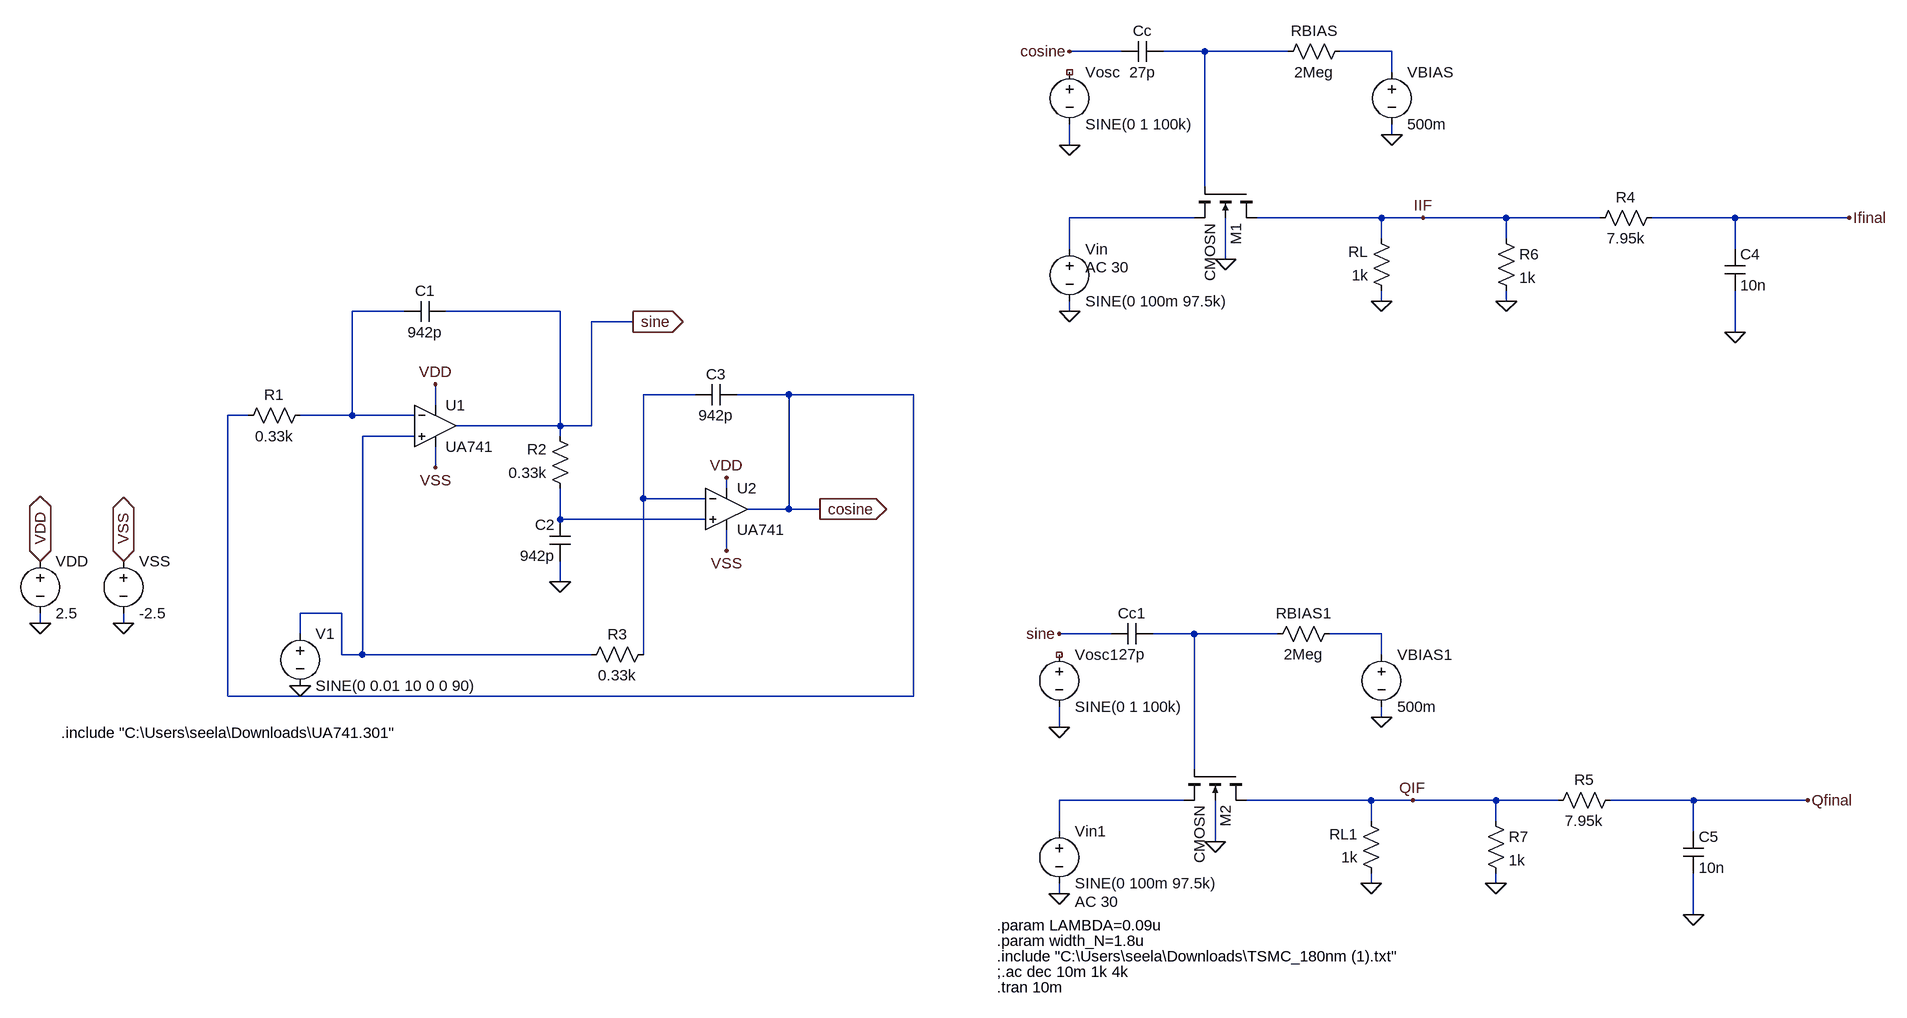
[diagram p0: schematic final.asc]
final.asc, the LTspice schematic file:
Version 4
SHEET 1 3272 1040
WIRE 1216 -416 1136 -416
WIRE 1344 -416 1280 -416
WIRE 1472 -416 1344 -416
WIRE 1632 -416 1552 -416
WIRE 1632 -384 1632 -416
WIRE 1632 -288 1632 -304
WIRE 1136 -272 1136 -304
WIRE 1344 -208 1344 -416
WIRE 1328 -160 1136 -160
WIRE 1616 -160 1424 -160
WIRE 1680 -160 1616 -160
WIRE 1808 -160 1680 -160
WIRE 1952 -160 1808 -160
WIRE 2160 -160 2032 -160
WIRE 2336 -160 2160 -160
WIRE 1616 -128 1616 -160
WIRE 1808 -128 1808 -160
WIRE 1136 -112 1136 -160
WIRE 2160 -112 2160 -160
WIRE 1376 -96 1376 -160
WIRE 1616 -32 1616 -48
WIRE 1808 -32 1808 -48
WIRE 112 -16 32 -16
WIRE 352 -16 176 -16
WIRE 1136 -16 1136 -32
WIRE 464 0 400 0
WIRE 2160 16 2160 -48
WIRE 560 112 480 112
WIRE 704 112 624 112
WIRE 896 112 704 112
WIRE 160 128 160 96
WIRE -128 144 -160 144
WIRE 32 144 32 -16
WIRE 32 144 -48 144
WIRE 128 144 32 144
WIRE 352 160 352 -16
WIRE 352 160 192 160
WIRE 400 160 400 0
WIRE 400 160 352 160
WIRE 128 176 48 176
WIRE 352 176 352 160
WIRE 160 224 160 192
WIRE 608 256 608 240
WIRE 480 272 480 112
WIRE 576 272 480 272
WIRE 704 288 704 112
WIRE 704 288 640 288
WIRE 752 288 704 288
WIRE 352 304 352 256
WIRE 576 304 352 304
WIRE 608 352 608 320
WIRE 352 400 352 368
WIRE 16 448 -48 448
WIRE -448 464 -448 448
WIRE -320 464 -320 448
WIRE -48 480 -48 448
WIRE 1200 480 1120 480
WIRE 1328 480 1264 480
WIRE 1456 480 1328 480
WIRE 1616 480 1536 480
WIRE 16 512 16 448
WIRE 48 512 48 176
WIRE 48 512 16 512
WIRE 400 512 48 512
WIRE 480 512 480 272
WIRE 1616 512 1616 480
WIRE -160 576 -160 144
WIRE 896 576 896 112
WIRE 896 576 -160 576
WIRE 1616 608 1616 592
WIRE 1120 624 1120 592
WIRE 1328 688 1328 480
WIRE 1312 736 1120 736
WIRE 1600 736 1408 736
WIRE 1664 736 1600 736
WIRE 1792 736 1664 736
WIRE 1888 736 1792 736
WIRE 2096 736 1968 736
WIRE 2272 736 2096 736
WIRE 1600 768 1600 736
WIRE 1792 768 1792 736
WIRE 1120 784 1120 736
WIRE 2096 784 2096 736
WIRE 1360 800 1360 736
WIRE 1600 864 1600 848
WIRE 1792 864 1792 848
WIRE 1120 880 1120 864
WIRE 2096 912 2096 848
FLAG -448 464 0
FLAG -320 464 0
FLAG -320 368 VSS
IOPIN -320 368 BiDir
FLAG -448 368 VDD
IOPIN -448 368 BiDir
FLAG 160 96 VDD
FLAG 160 224 VSS
FLAG 608 240 VDD
FLAG 608 352 VSS
FLAG 352 400 0
FLAG -48 560 0
FLAG 464 0 sine
IOPIN 464 0 Out
FLAG 752 288 cosine
IOPIN 752 288 Out
FLAG 1376 -96 0
FLAG 1632 -288 0
FLAG 1616 -32 0
FLAG 1136 -16 0
FLAG 1136 -272 0
FLAG 1680 -160 IIF
FLAG 2160 16 0
FLAG 1136 -416 cosine
FLAG 1360 800 0
FLAG 1616 608 0
FLAG 1600 864 0
FLAG 1120 880 0
FLAG 1120 624 0
FLAG 1664 736 QIF
FLAG 1120 480 sine
FLAG 2096 912 0
FLAG 2272 736 Qfinal
FLAG 2336 -160 Ifinal
FLAG 1792 864 0
FLAG 1808 -32 0
DATAFLAG 1696 -160 ""
SYMBOL OpAmps\\opamp2 160 96 R0
SYMATTR InstName U1
SYMATTR Value UA741
SYMBOL voltage -448 352 R0
WINDOW 123 0 0 Left 0
WINDOW 39 0 0 Left 0
SYMATTR InstName VDD
SYMATTR Value 2.5
SYMBOL voltage -320 352 R0
WINDOW 123 0 0 Left 0
WINDOW 39 0 0 Left 0
SYMATTR InstName VSS
SYMATTR Value -2.5
SYMBOL OpAmps\\opamp2 608 224 R0
SYMATTR InstName U2
SYMATTR Value UA741
SYMBOL cap 176 -32 R90
WINDOW 0 0 32 VBottom 2
WINDOW 3 32 32 VTop 2
SYMATTR InstName C1
SYMATTR Value 942p
SYMBOL cap 368 368 R180
WINDOW 0 24 56 Left 2
WINDOW 3 24 8 Left 2
SYMATTR InstName C2
SYMATTR Value 942p
SYMBOL cap 624 96 R90
WINDOW 0 0 32 VBottom 2
WINDOW 3 32 32 VTop 2
SYMATTR InstName C3
SYMATTR Value 942p
SYMBOL res -32 128 R90
WINDOW 0 0 56 VBottom 2
WINDOW 3 32 56 VTop 2
SYMATTR InstName R1
SYMATTR Value 0.33k
SYMBOL res 368 272 R180
WINDOW 0 36 76 Left 2
WINDOW 3 36 40 Left 2
SYMATTR InstName R2
SYMATTR Value 0.33k
SYMBOL res 384 528 R270
WINDOW 0 32 56 VTop 2
WINDOW 3 0 56 VBottom 2
SYMATTR InstName R3
SYMATTR Value 0.33k
SYMBOL voltage -48 464 R0
WINDOW 123 24 124 Left 2
WINDOW 39 0 0 Left 0
SYMATTR InstName V1
SYMATTR Value SINE(0 0.01 10 0 0 90)
SYMBOL nmos4 1424 -208 R90
SYMATTR InstName M1
SYMATTR Value CMOSN
SYMATTR Value2 l={2*LAMBDA} w={width_N} ad={5*width_N*LAMBDA} as={5*width_N*LAMBDA} pd={10*LAMBDA+2*width_N} ps={10*LAMBDA+2*width_N}
SYMBOL voltage 1136 -128 R0
WINDOW 123 24 44 Left 2
WINDOW 39 0 0 Left 0
SYMATTR Value2 AC 30
SYMATTR InstName Vin
SYMATTR Value SINE(0 100m 97.5k)
SYMBOL voltage 1136 -400 R0
WINDOW 123 0 0 Left 0
WINDOW 39 0 0 Left 0
SYMATTR InstName Vosc
SYMATTR Value SINE(0 1 100k)
SYMBOL voltage 1632 -400 R0
WINDOW 123 0 0 Left 0
WINDOW 39 0 0 Left 0
SYMATTR InstName VBIAS
SYMATTR Value 500m
SYMBOL res 1568 -432 R90
WINDOW 0 0 56 VBottom 2
WINDOW 3 32 56 VTop 2
SYMATTR InstName RBIAS
SYMATTR Value 2Meg
SYMBOL res 1632 -32 R180
WINDOW 0 36 76 Left 2
WINDOW 3 36 40 Left 2
SYMATTR InstName RL
SYMATTR Value 1k
SYMBOL cap 1280 -432 R90
WINDOW 0 0 32 VBottom 2
WINDOW 3 32 32 VTop 2
SYMATTR InstName Cc
SYMATTR Value 27p
SYMBOL res 2048 -176 R90
WINDOW 0 0 56 VBottom 2
WINDOW 3 32 56 VTop 2
SYMATTR InstName R4
SYMATTR Value 7.95k
SYMBOL cap 2144 -112 R0
SYMATTR InstName C4
SYMATTR Value 10n
SYMBOL nmos4 1408 688 R90
SYMATTR InstName M2
SYMATTR Value CMOSN
SYMATTR Value2 l={2*LAMBDA} w={width_N} ad={5*width_N*LAMBDA} as={5*width_N*LAMBDA} pd={10*LAMBDA+2*width_N} ps={10*LAMBDA+2*width_N}
SYMBOL voltage 1120 768 R0
WINDOW 123 24 124 Left 2
WINDOW 39 0 0 Left 0
SYMATTR Value2 AC 30
SYMATTR InstName Vin1
SYMATTR Value SINE(0 100m 97.5k)
SYMBOL voltage 1120 496 R0
WINDOW 123 0 0 Left 0
WINDOW 39 0 0 Left 0
SYMATTR InstName Vosc1
SYMATTR Value SINE(0 1 100k)
SYMBOL voltage 1616 496 R0
WINDOW 123 0 0 Left 0
WINDOW 39 0 0 Left 0
SYMATTR InstName VBIAS1
SYMATTR Value 500m
SYMBOL res 1552 464 R90
WINDOW 0 0 56 VBottom 2
WINDOW 3 32 56 VTop 2
SYMATTR InstName RBIAS1
SYMATTR Value 2Meg
SYMBOL res 1616 864 R180
WINDOW 0 36 76 Left 2
WINDOW 3 36 40 Left 2
SYMATTR InstName RL1
SYMATTR Value 1k
SYMBOL cap 1264 464 R90
WINDOW 0 0 32 VBottom 2
WINDOW 3 32 32 VTop 2
SYMATTR InstName Cc1
SYMATTR Value 27p
SYMBOL res 1984 720 R90
WINDOW 0 0 56 VBottom 2
WINDOW 3 32 56 VTop 2
SYMATTR InstName R5
SYMATTR Value 7.95k
SYMBOL cap 2080 784 R0
SYMATTR InstName C5
SYMATTR Value 10n
SYMBOL res 1792 -144 R0
SYMATTR InstName R6
SYMATTR Value 1k
SYMBOL res 1776 752 R0
SYMATTR InstName R7
SYMATTR Value 1k
TEXT -416 632 Left 2 !.include "C:\\Users\\seela\\Downloads\\UA741.301"
TEXT 1024 976 Left 2 !.include "C:\\Users\\seela\\Downloads\\TSMC_180nm (1).txt"
TEXT 1024 928 Left 2 !.param LAMBDA=0.09u
TEXT 1024 952 Left 2 !.param width_N=1.8u
TEXT 1024 1000 Left 2 !;.ac dec 10m 1k 4k
TEXT 1024 1024 Left 2 !.tran 10m

The netlist it stands for:
* final.asc
XU1 N006 N004 VDD VSS sine UA741  ; pins In+ In- V+ V- OUT
VDD VDD 0 2.5
VSS VSS 0 -2.5
XU2 N007 N005 VDD VSS cosine UA741  ; pins In+ In- V+ V- OUT
C1 sine N004 942p
C2 0 N007 942p
C3 cosine N005 942p
R1 N004 cosine 0.33k
R2 N007 sine 0.33k
R3 N006 N005 0.33k
V1 N006 0 SINE(0 0.01 10 0 0 90)
M1 IIF N001 N003 0 CMOSN l={2*LAMBDA} w={width_N} ad={5*width_N*LAMBDA} as={5*width_N*LAMBDA} pd={10*LAMBDA+2*width_N} ps={10*LAMBDA+2*width_N}
Vin N003 0 SINE(0 100m 97.5k) AC 30
Vosc NC_01 0 SINE(0 1 100k)
VBIAS N002 0 500m
RBIAS N002 N001 2Meg
RL 0 IIF 1k
Cc N001 cosine 27p
R4 Ifinal IIF 7.95k
C4 Ifinal 0 10n
M2 QIF N008 N010 0 CMOSN l={2*LAMBDA} w={width_N} ad={5*width_N*LAMBDA} as={5*width_N*LAMBDA} pd={10*LAMBDA+2*width_N} ps={10*LAMBDA+2*width_N}
Vin1 N010 0 SINE(0 100m 97.5k) AC 30
Vosc1 NC_02 0 SINE(0 1 100k)
VBIAS1 N009 0 500m
RBIAS1 N009 N008 2Meg
RL1 0 QIF 1k
Cc1 N008 sine 27p
R5 Qfinal QIF 7.95k
C5 Qfinal 0 10n
R6 IIF 0 1k
R7 QIF 0 1k
.model NMOS NMOS
.model PMOS PMOS
.lib standard.mos
.include "C:\Users\seela\Downloads\UA741.301"
.include "C:\Users\seela\Downloads\TSMC_180nm (1).txt"
.param LAMBDA=0.09u
.param width_N=1.8u
;.ac dec 10m 1k 4k
.tran 10m
.backanno
.end